# Altium project keyboard.PrjPCB
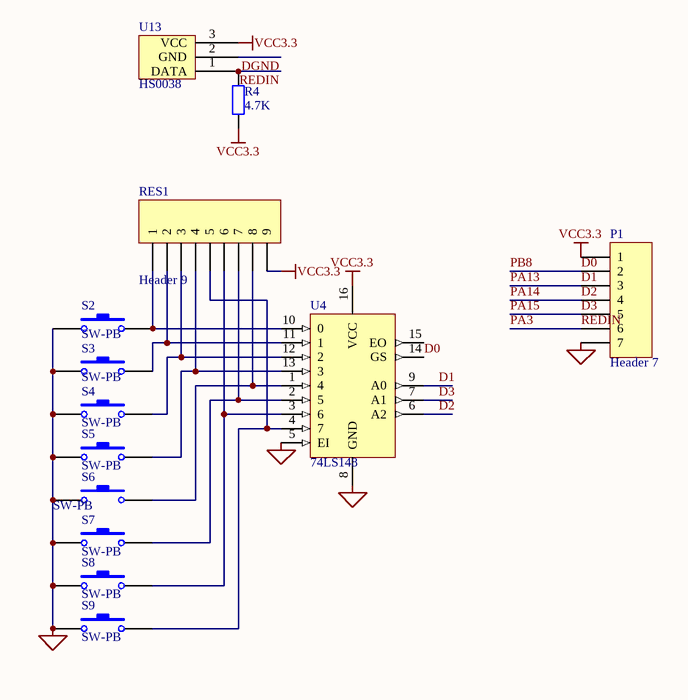
[diagram p0: keyboard.SchDoc]
1 sheet, 13 parts. Net scope: global (net labels, ports and power ports of the same name join across sheets).
Board file: keyboard.PcbDoc

## Sheet keyboard.SchDoc
size A4

### Parts
P1  Header 7  [HDR1X7]
R4  4.7K  [1608[0603]]
RES1  Header 9  [HDR1X9]
S2  SW-PB  [SW]
S3  SW-PB  [SW]
S4  SW-PB  [SW]
S5  SW-PB  [SW]
S6  SW-PB  [AN12]
S7  SW-PB  [AN12]
S8  SW-PB  [AN12]
S9  SW-PB  [AN12]
U4  74LS148  [DIP-16]
U13  HS0038  [HS0038]

### Nets
DGND: P1.7 S2.1 S3.1 S4.1 S5.4 S6.1 S7.1 S8.1 S9.1 U4.5(EI) U4.8(GND) U13.2(GND)  [also labelled GND]
VCC: P1.1 R4.2 RES1.9 U4.16(VCC) U13.3(VCC)  [also labelled VCC3.3]
D0: P1.2 U4.14(GS)  [also labelled PB8]
D1: P1.3 U4.9(A0)  [also labelled PA13]
D2: P1.4 U4.6(A2)  [also labelled PA14]
D3: P1.5 U4.7(A1)  [also labelled PA15]
PA3: P1.6 R4.1 U13.1(DATA)  [also labelled REDIN]
NetRES1_1: RES1.1 S2.2 U4.10(0)
NetRES1_2: RES1.2 S3.2 U4.11(1)
NetRES1_3: RES1.3 S4.2 U4.12(2)
NetRES1_4: RES1.4 S5.2 U4.13(3)
NetRES1_5: RES1.5 S9.2 U4.4(7)
NetRES1_6: RES1.6 S8.2 U4.3(6)
NetRES1_7: RES1.7 S7.2 U4.2(5)
NetRES1_8: RES1.8 S6.2 U4.1(4)

Not connected (* = marked no-connect by the designer): U4 15(EO)

### Library data of the parts
P1 = Header 7: Header, 7-Pin; LatestRevisionDate: 17-Jul-2002; LatestRevisionNote: Re-released for DXP Platform.; Publisher: Altium Limited
R4 = Res2: Resistor; Published: 8-Jun-2000; LatestRevisionDate: 17-Jul-2002; LatestRevisionNote: Re-released for DXP Platform.; Publisher: Altium Limited
RES1 = Header 9: Header, 9-Pin; LatestRevisionDate: 17-Jul-2002; LatestRevisionNote: Re-released for DXP Platform.; Publisher: Altium Limited
S2-S9 = SW-PB: Switch; pin to pad: 1>4; Published: 24-Mar-1999; LatestRevisionDate: 17-Jul-2002; LatestRevisionNote: Re-released for DXP Platform.; Publisher: Altium Limited
U4 = 74LS148: 8-Line to 3-Line Priority Encoder